# EAGLE design diagnostic-main (EAGLE 9.5.2)

## Sheet 1 of 3: MCU
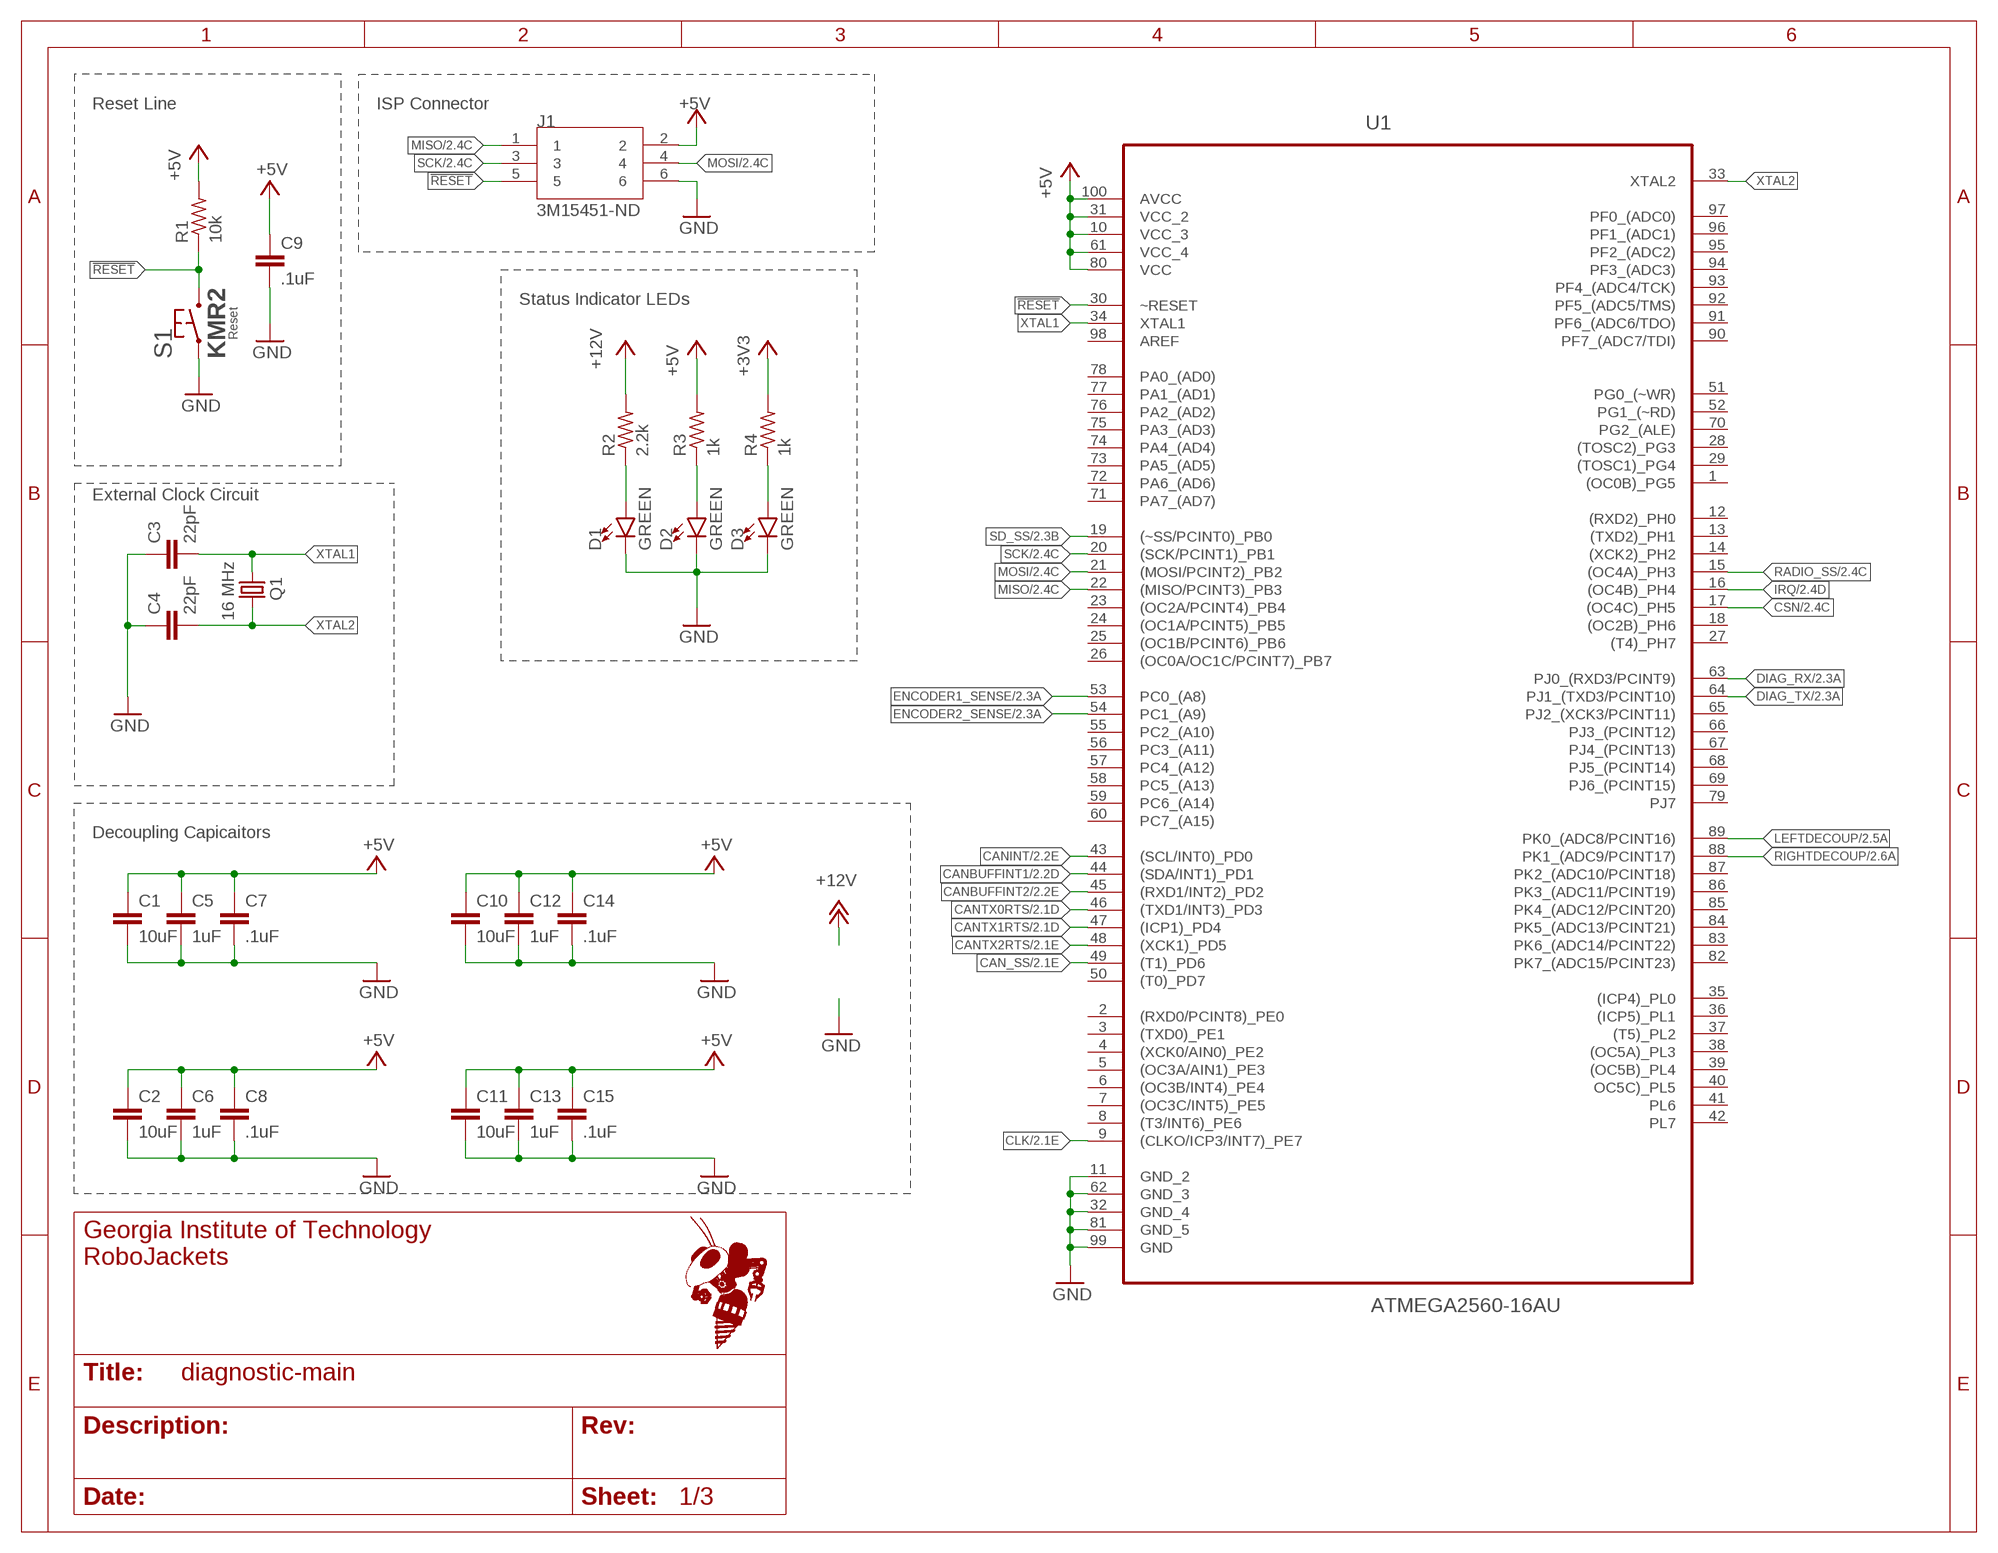
[diagram p0: schematic, sheet 1]

### Parts
C1  10uF  C-EUC0805  [C0805]
C2  10uF  C-EUC0805  [C0805]
C3  22pF  C-EUC0603  [C0603]
C4  22pF  C-EUC0603  [C0603]
C5  1uF  C-EUC0603  [C0603]
C6  1uF  C-EUC0603  [C0603]
C7  .1uF  C-EUC0603  [C0603]
C8  .1uF  C-EUC0603  [C0603]
C9  .1uF  C-EUC0603  [C0603]
C10  10uF  C-EUC0805  [C0805]
C11  10uF  C-EUC0805  [C0805]
C12  1uF  C-EUC0603  [C0603]
C13  1uF  C-EUC0603  [C0603]
C14  .1uF  C-EUC0603  [C0603]
C15  .1uF  C-EUC0603  [C0603]
D1  GREEN  LED-BLUE0603  [LED-0603]
D2  GREEN  LED-GREEN0603  [LED-0603]
D3  GREEN  LED-GREEN0603  [LED-0603]
J1  3M15451-ND  30306-6002HB  [3M_30306-6002HB]
Q1  16 MHz  CSM-7X-DU  [CSM-7X-DU]
R1  10k  R-US_R0603  [R0603]
R2  2.2k  R-US_R0603  [R0603]
R3  1k  R-US_R0603  [R0603]
R4  1k  R-US_R0603  [R0603]
S1  KMR2  [KMR2]
U1  ATMEGA2560-16AU  [QFP50P1600X1600X120-100N]

### Nets
3V3_LED_R: D3.A R4.1
5V_LED_R: D2.A R3.1
12V_LED_R: D1.A R2.1
!RESET: J1.5 R1.1 S1.2.1 S1.2.2 U1.30(~RESET)
+3V3: R4.2 ; also sheet 2,3
+5V: C1.1 C2.1 C5.1 C6.1 C7.1 C8.1 C9.1 C10.1 C11.1 C12.1 C13.1 C14.1 C15.1 J1.2 R1.2 R3.2 U1.10(VCC_3) U1.31(VCC_2) U1.61(VCC_4) U1.80(VCC) U1.100(AVCC) ; also sheet 2,3
+12V: R2.2 ; also sheet 2,3
CAN_SS: U1.49((T1)_PD6) ; also sheet 2
CANBUFFINT1: U1.44((SDA/INT1)_PD1) ; also sheet 2
CANBUFFINT2: U1.45((RXD1/INT2)_PD2) ; also sheet 2
CANINT: U1.43((SCL/INT0)_PD0) ; also sheet 2
CANTX0RTS: U1.46((TXD1/INT3)_PD3) ; also sheet 2
CANTX1RTS: U1.47((ICP1)_PD4) ; also sheet 2
CANTX2RTS: U1.48((XCK1)_PD5) ; also sheet 2
CLK: U1.9((CLKO/ICP3/INT7)_PE7) ; also sheet 2
CSN: U1.17((OC4C)_PH5) ; also sheet 2
DIAG_RX: U1.63(PJ0_(RXD3/PCINT9)) ; also sheet 2
DIAG_TX: U1.64(PJ1_(TXD3/PCINT10)) ; also sheet 2
ENCODER1_SENSE: U1.53(PC0_(A8)) ; also sheet 2
ENCODER2_SENSE: U1.54(PC1_(A9)) ; also sheet 2
GND: C1.2 C2.2 C3.1 C4.1 C5.2 C6.2 C7.2 C8.2 C9.2 C10.2 C11.2 C12.2 C13.2 C14.2 C15.2 D1.C D2.C D3.C J1.6 S1.1.1 S1.1.2 U1.11(GND_2) U1.32(GND_4) U1.62(GND_3) U1.81(GND_5) U1.99(GND) ; also sheet 2,3
IRQ: U1.16((OC4B)_PH4) ; also sheet 2
LEFTDECOUP: U1.89(PK0_(ADC8/PCINT16)) ; also sheet 2
MISO: J1.1 U1.22((MISO/PCINT3)_PB3) ; also sheet 2
MOSI: J1.4 U1.21((MOSI/PCINT2)_PB2) ; also sheet 2
RADIO_SS: U1.15((OC4A)_PH3) ; also sheet 2
RIGHTDECOUP: U1.88(PK1_(ADC9/PCINT17)) ; also sheet 2
SCK: J1.3 U1.20((SCK/PCINT1)_PB1) ; also sheet 2
SD_SS: U1.19((~SS/PCINT0)_PB0) ; also sheet 2
XTAL1: C3.2 Q1.1 U1.34(XTAL1)
XTAL2: C4.2 Q1.2 U1.33(XTAL2)
Unconnected: U1.1((OC0B)_PG5) U1.2((RXD0/PCINT8)_PE0) U1.3((TXD0)_PE1) U1.4((XCK0/AIN0)_PE2) U1.5((OC3A/AIN1)_PE3) U1.6((OC3B/INT4)_PE4) U1.7((OC3C/INT5)_PE5) U1.8((T3/INT6)_PE6) U1.12((RXD2)_PH0) U1.13((TXD2)_PH1) U1.14((XCK2)_PH2) U1.18((OC2B)_PH6) U1.23((OC2A/PCINT4)_PB4) U1.24((OC1A/PCINT5)_PB5) U1.25((OC1B/PCINT6)_PB6) U1.26((OC0A/OC1C/PCINT7)_PB7) U1.27((T4)_PH7) U1.28((TOSC2)_PG3) U1.29((TOSC1)_PG4) U1.35((ICP4)_PL0) U1.36((ICP5)_PL1) U1.37((T5)_PL2) U1.38((OC5A)_PL3) U1.39((OC5B)_PL4) U1.40(OC5C)_PL5) U1.41(PL6) U1.42(PL7) U1.50((T0)_PD7) U1.51(PG0_(~WR)) U1.52(PG1_(~RD)) U1.55(PC2_(A10)) U1.56(PC3_(A11)) U1.57(PC4_(A12)) U1.58(PC5_(A13)) U1.59(PC6_(A14)) U1.60(PC7_(A15)) U1.65(PJ2_(XCK3/PCINT11)) U1.66(PJ3_(PCINT12)) U1.67(PJ4_(PCINT13)) U1.68(PJ5_(PCINT14)) U1.69(PJ6_(PCINT15)) U1.70(PG2_(ALE)) U1.71(PA7_(AD7)) U1.72(PA6_(AD6)) U1.73(PA5_(AD5)) U1.74(PA4_(AD4)) U1.75(PA3_(AD3)) U1.76(PA2_(AD2)) U1.77(PA1_(AD1)) U1.78(PA0_(AD0)) U1.79(PJ7) U1.82(PK7_(ADC15/PCINT23)) U1.83(PK6_(ADC14/PCINT22)) U1.84(PK5_(ADC13/PCINT21)) U1.85(PK4_(ADC12/PCINT20)) U1.86(PK3_(ADC11/PCINT19)) U1.87(PK2_(ADC10/PCINT18)) U1.90(PF7_(ADC7/TDI)) U1.91(PF6_(ADC6/TDO)) U1.92(PF5_(ADC5/TMS)) U1.93(PF4_(ADC4/TCK)) U1.94(PF3_(ADC3)) U1.95(PF2_(ADC2)) U1.96(PF1_(ADC1)) U1.97(PF0_(ADC0)) U1.98(AREF)

### Notes on the sheet
- Reset Line | ISP Connector
- Status Indicator LEDs
- External Clock Circuit
- Decoupling Capicaitors

## Sheet 2 of 3: Connectors
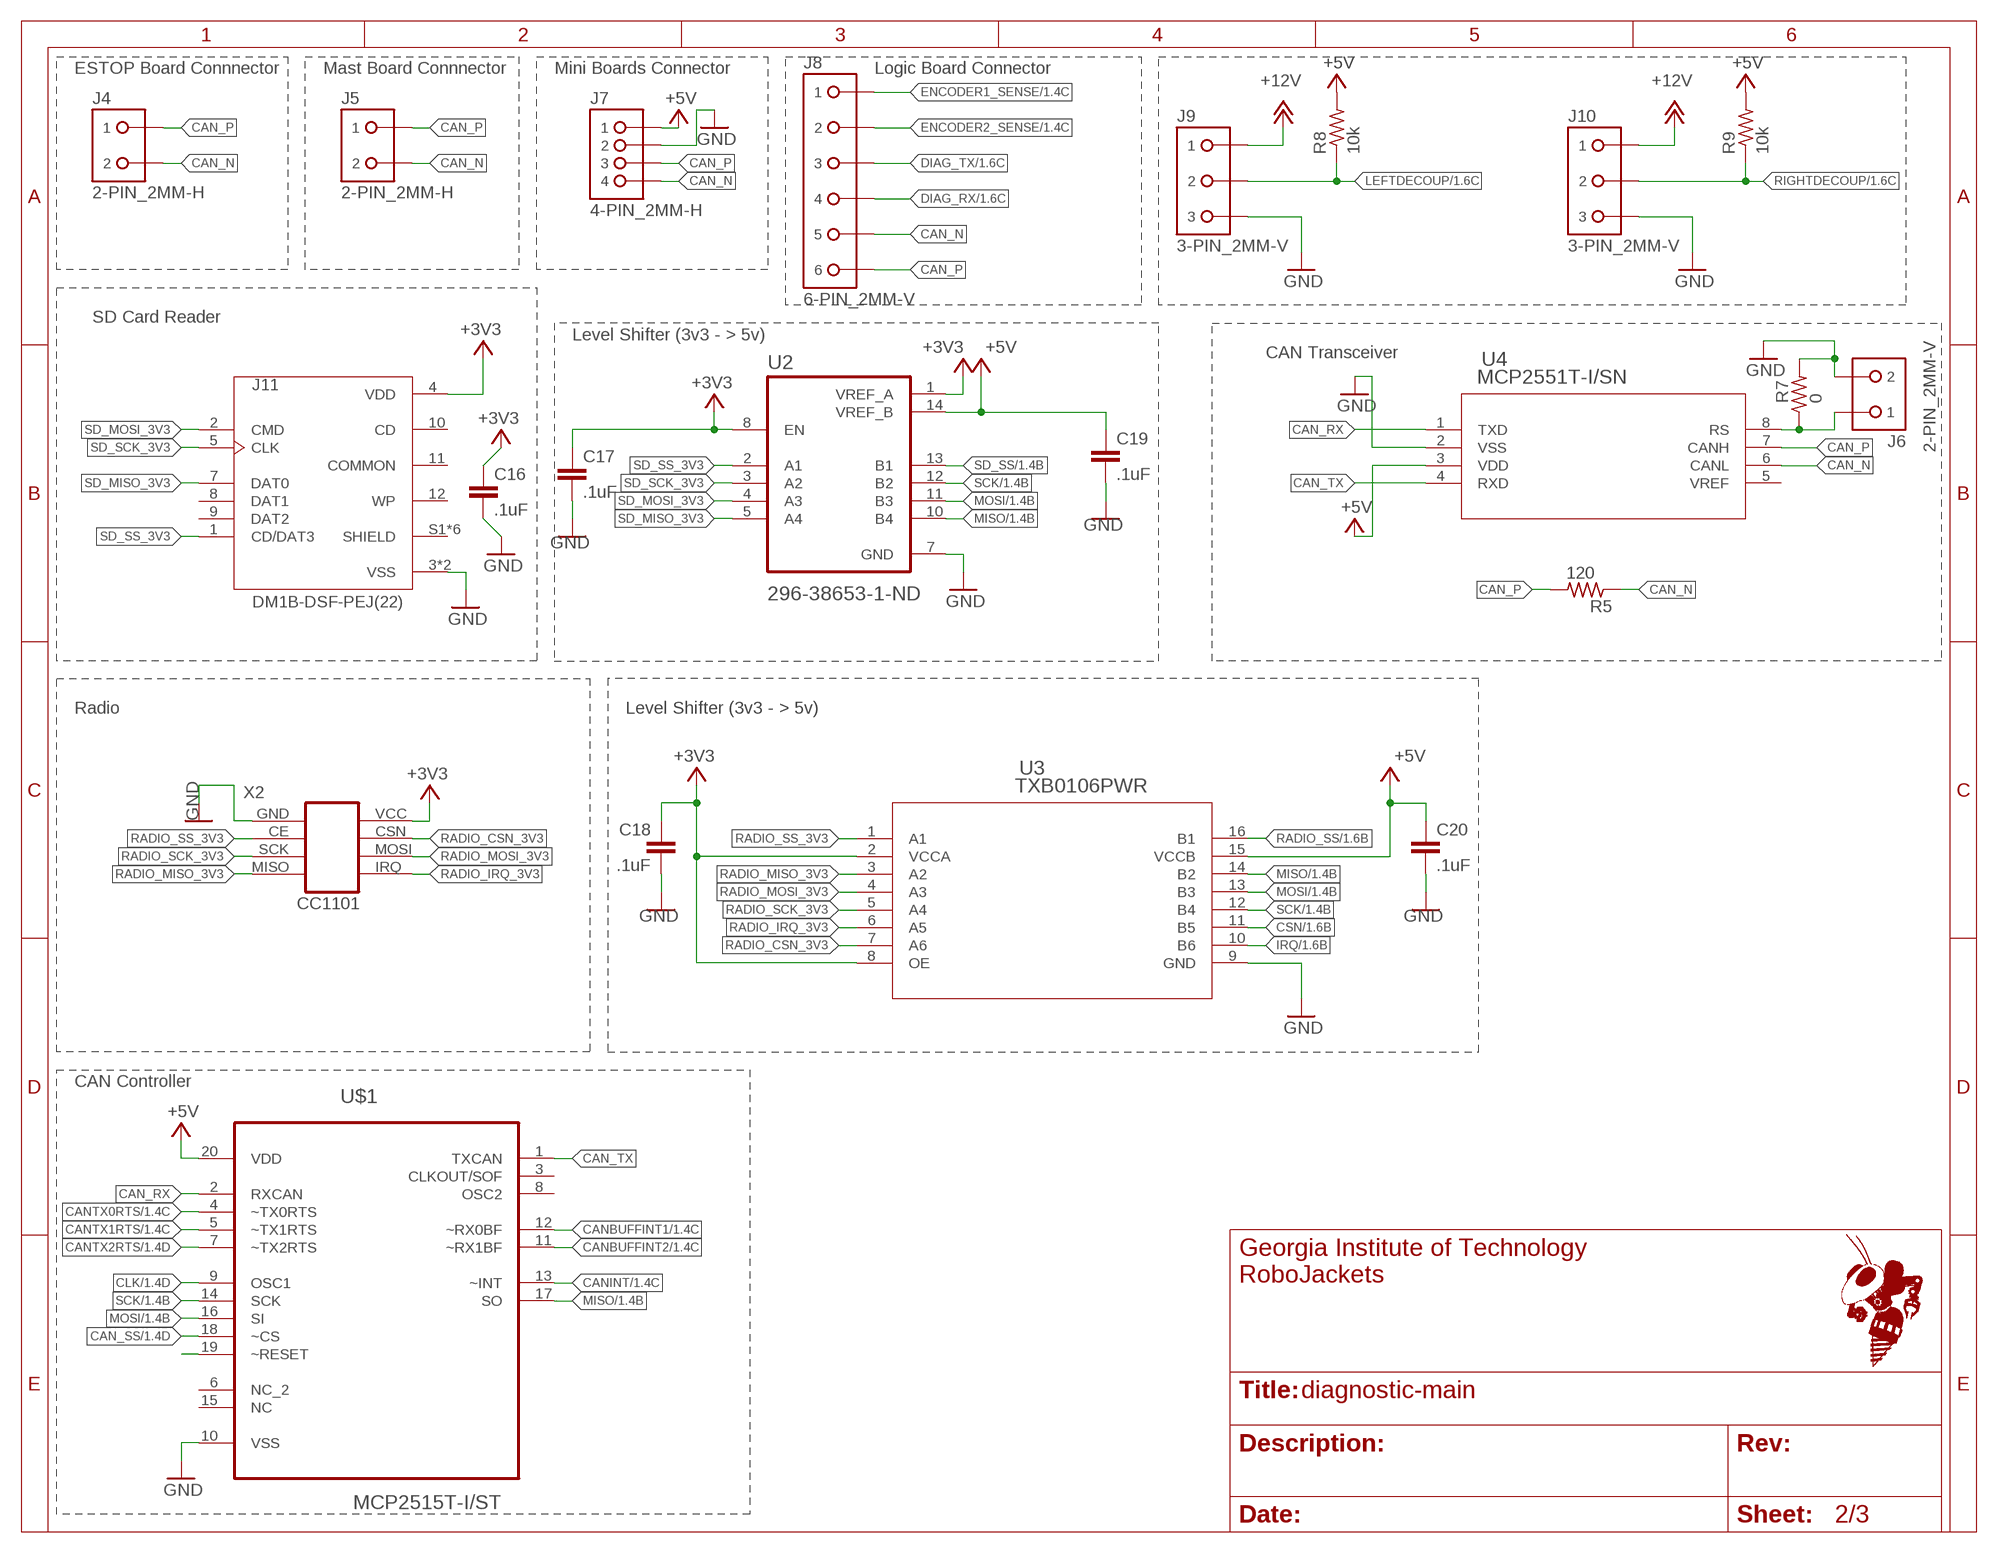
[diagram p1: schematic, sheet 2]

### Parts
C16  .1uF  C-EUC0603  [C0603]
C17  .1uF  C-EUC0603  [C0603]
C18  .1uF  C-EUC0603  [C0603]
C19  .1uF  C-EUC0603  [C0603]
C20  .1uF  C-EUC0603  [C0603]
J4  2-PIN_2MM-H  [2MM-2-H]
J5  2-PIN_2MM-H  [2MM-2-H]
J6  2-PIN_2MM-V  [2MM-2-V]
J7  4-PIN_2MM-H  [2MM-4-H]
J8  6-PIN_2MM-V  [2MM-6-V]
J9  3-PIN_2MM-V  [2MM-3-V]
J10  3-PIN_2MM-V  [2MM-3-V]
J11  DM1B-DSF-PEJ(22)  [JST_DM1B-DSF-PEJ(22)]
R5  120  R-US_R0603  [R0603]
R7  0  R-US_R0603  [R0603]
R8  10k  R-US_R0603  [R0603]
R9  10k  R-US_R0603  [R0603]
U2  296-38653-1-ND  LSF0204PWR  [SOP65P640X120-14N]
U3  TXB0106PWR  [PW16]
U4  MCP2551T-I/SN  [SOIC8-N_MC]
U$1  MCP2515T-I/ST  [SOP65P640X110-20N]
X2  CC1101  NRF24L01+PA+LNA  [NRF24L01+PA+LNA]

### Nets
+3V3: C16.1 C17.1 C18.1 J11.4(VDD) U2.1(VREF_A) U2.8(EN) U3.2(VCCA) U3.8(OE) X2.VCC ; also sheet 1,3
+5V: C19.1 C20.1 J7.1 R8.2 R9.2 U2.14(VREF_B) U3.15(VCCB) U4.3(VDD) U$1.20(VDD) ; also sheet 1,3
+12V: J9.1 J10.1 ; also sheet 1,3
CAN_N: J4.2 J5.2 J7.4 J8.5 R5.1 U4.6(CANL)
CAN_P: J4.1 J5.1 J7.3 J8.6 R5.2 U4.7(CANH)
CAN_RX: U4.1(TXD) U$1.2(RXCAN)
CAN_SS: U$1.18(~CS) ; also sheet 1
CAN_TX: U4.4(RXD) U$1.1(TXCAN)
CANBUFFINT1: U$1.12(~RX0BF) ; also sheet 1
CANBUFFINT2: U$1.11(~RX1BF) ; also sheet 1
CANINT: U$1.13(~INT) ; also sheet 1
CANTX0RTS: U$1.4(~TX0RTS) ; also sheet 1
CANTX1RTS: U$1.5(~TX1RTS) ; also sheet 1
CANTX2RTS: U$1.7(~TX2RTS) ; also sheet 1
CLK: U$1.9(OSC1) ; also sheet 1
CSN: U3.11(B5) ; also sheet 1
DIAG_RX: J8.4 ; also sheet 1
DIAG_TX: J8.3 ; also sheet 1
ENCODER1_SENSE: J8.1 ; also sheet 1
ENCODER2_SENSE: J8.2 ; also sheet 1
GND: C16.2 C17.2 C18.2 C19.2 C20.2 J6.2 J7.2 J9.3 J10.3 J11.3(VSS) J11.6(VSS) R7.2 U2.7(GND) U3.9(GND) U4.2(VSS) U$1.10(VSS) X2.GND ; also sheet 1,3
IRQ: U3.10(B6) ; also sheet 1
LEFTDECOUP: J9.2 R8.1 ; also sheet 1
MISO: U2.10(B4) U3.14(B2) U$1.17(SO) ; also sheet 1
MOSI: U2.11(B3) U3.13(B3) U$1.16(SI) ; also sheet 1
N$5: U$1.19(~RESET)
RADIO_CSN_3V3: U3.7(A6) X2.CSN
RADIO_IRQ_3V3: U3.6(A5) X2.IRQ
RADIO_MISO_3V3: U3.3(A2) X2.MISO
RADIO_MOSI_3V3: U3.4(A3) X2.MOSI
RADIO_SCK_3V3: U3.5(A4) X2.SCK
RADIO_SS: U3.16(B1) ; also sheet 1
RADIO_SS_3V3: U3.1(A1) X2.CE
RIGHTDECOUP: J10.2 R9.1 ; also sheet 1
RS: J6.1 R7.1 U4.8(RS)
SCK: U2.12(B2) U3.12(B4) U$1.14(SCK) ; also sheet 1
SD_MISO_3V3: J11.7(DAT0) U2.5(A4)
SD_MOSI_3V3: J11.2(CMD) U2.4(A3)
SD_SCK_3V3: J11.5(CLK) U2.3(A2)
SD_SS: U2.13(B1) ; also sheet 1
SD_SS_3V3: J11.1(CD/DAT3) U2.2(A1)
Unconnected: J11.8(DAT1) J11.9(DAT2) J11.10(CD) J11.11(COMMON) J11.12(WP) J11.S1(SHIELD) J11.S2(SHIELD) J11.S3(SHIELD) J11.S4(SHIELD) J11.S5(SHIELD) J11.S6(SHIELD) U4.5(VREF) U$1.3(CLKOUT/SOF) U$1.6(NC_2) U$1.8(OSC2) U$1.15(NC)

### Notes on the sheet
- ESTOP Board Connnector | Mast Board Connnector | Mini Boards Connector | Logic Board Connector
- SD Card Reader
- Level Shifter (3v3 - > 5v)
- CAN Transceiver
- Radio | Level Shifter (3v3 - > 5v)
- CAN Controller

## Sheet 3 of 3: Power
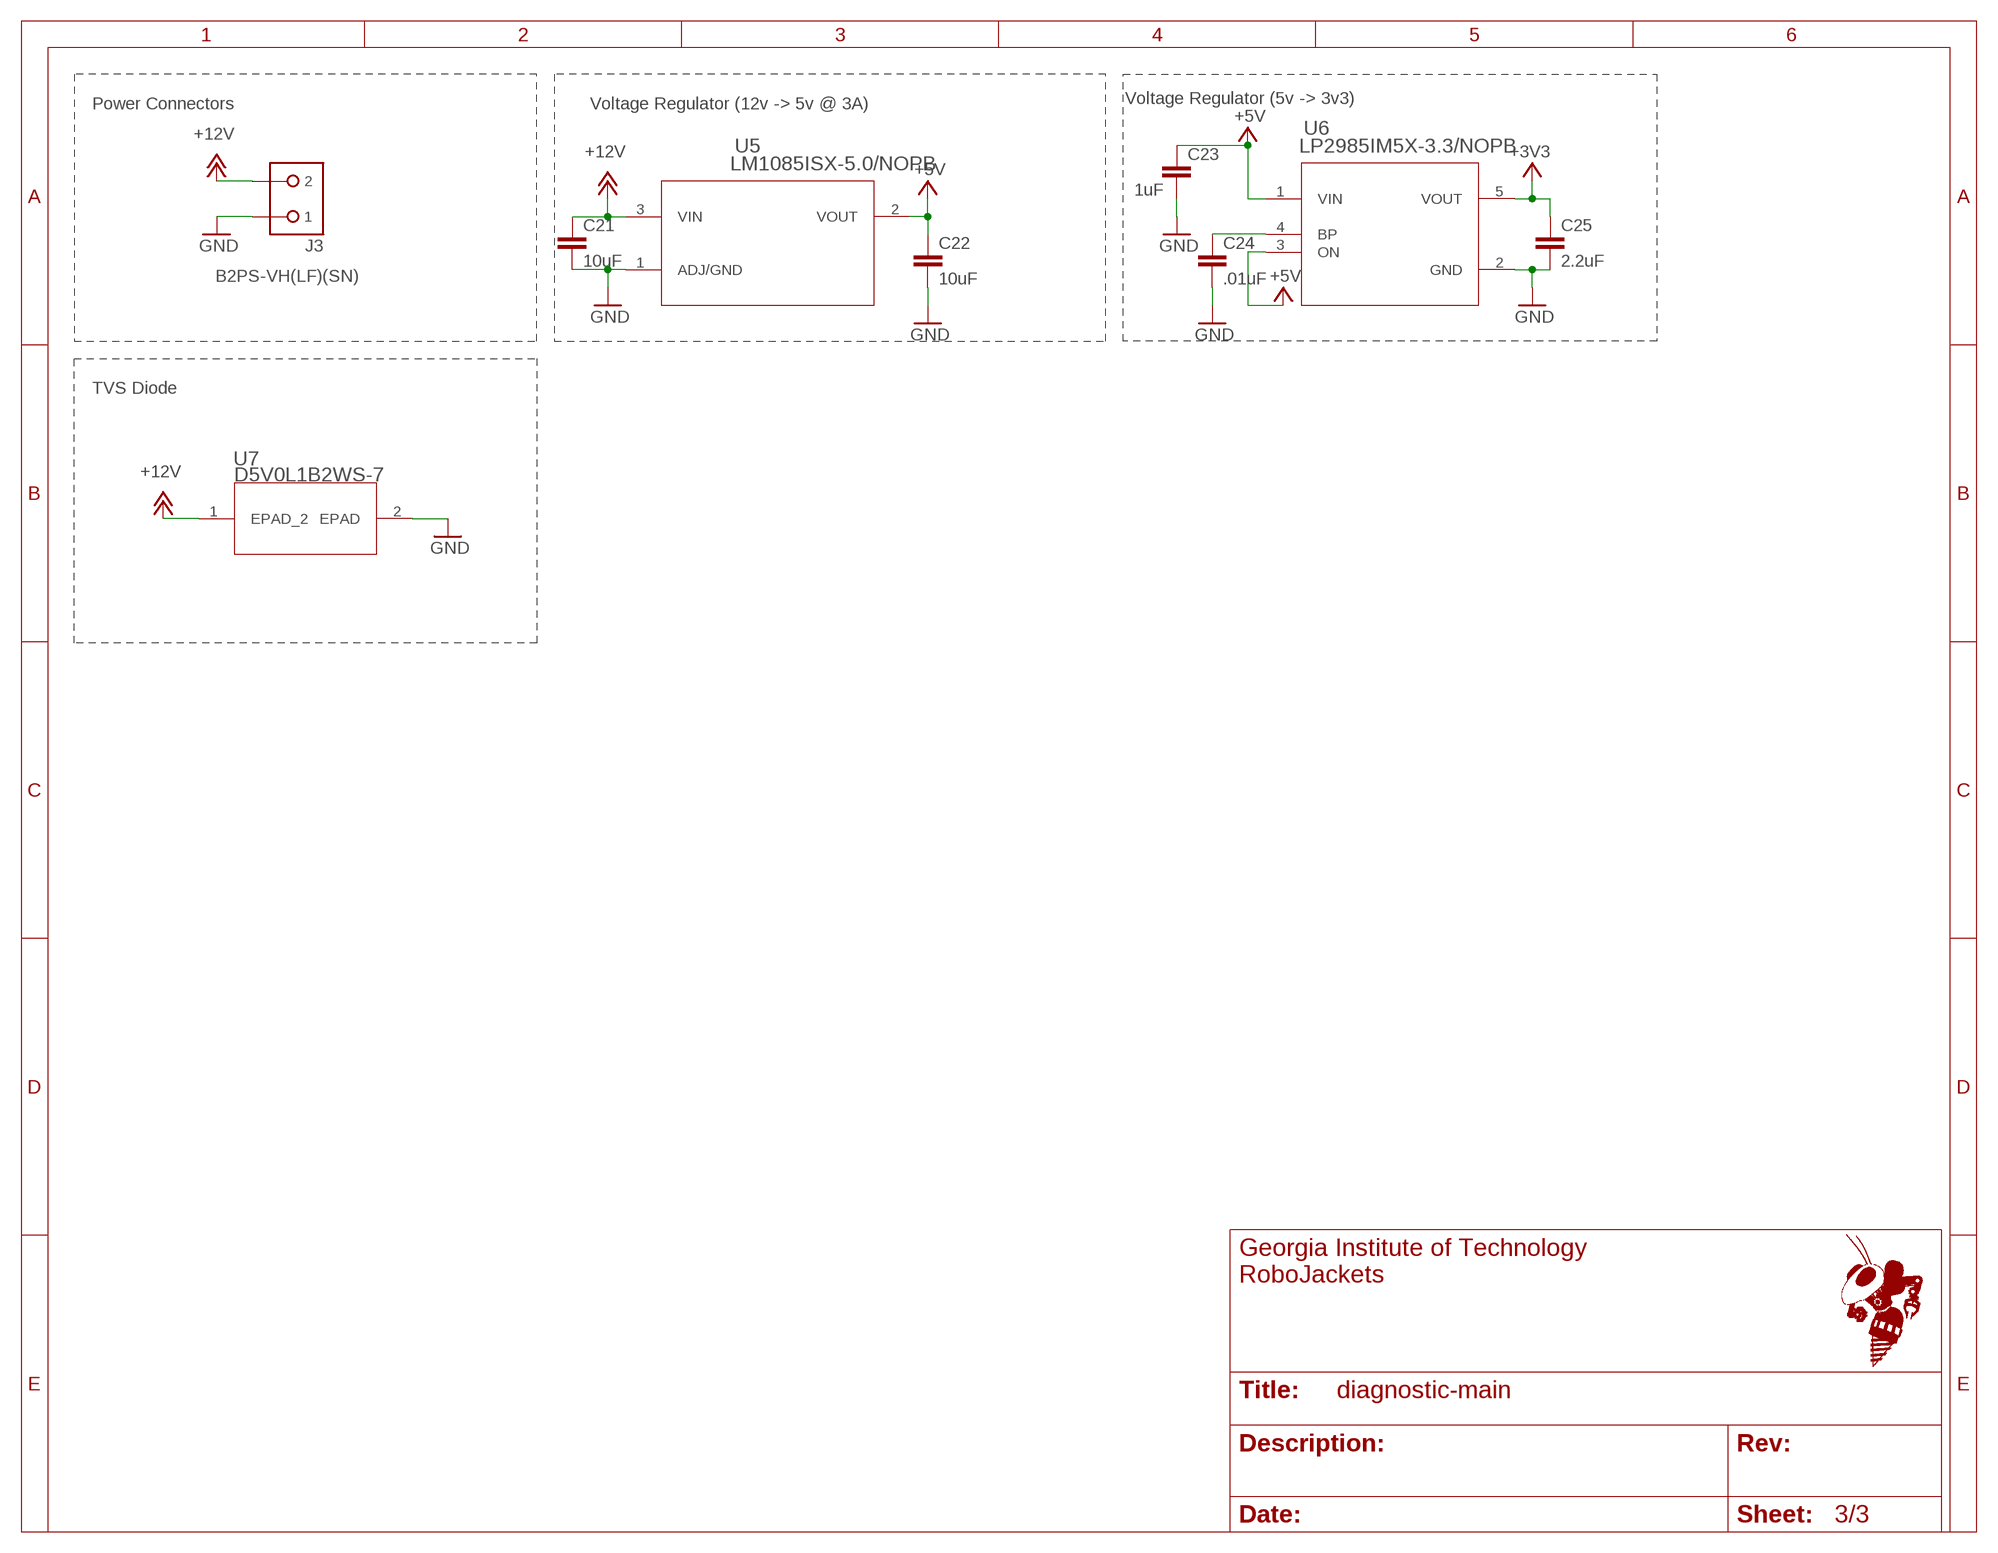
[diagram p2: schematic, sheet 3]

### Parts
C21  10uF  C-EUC0805  [C0805]
C22  10uF  C-EUC0805  [C0805]
C23  1uF  C-EUC0603  [C0603]
C24  .01uF  C-EUC0603  [C0603]
C25  2.2uF  C-EUC0603  [C0603]
J3  B2PS-VH(LF)(SN)  [B2PS-CENTERED]
U5  LM1085ISX-5.0/NOPB  [TS3B]
U6  LP2985IM5X-3.3/NOPB  [MF05A]
U7  D5V0L1B2WS-7  [SOD323]

### Nets
+3V3: C25.1 U6.5(VOUT) ; also sheet 1,2
+5V: C22.1 C23.1 U5.2(VOUT) U6.1(VIN) U6.3(ON) ; also sheet 1,2
+12V: C21.1 J3.2 U5.3(VIN) U7.1(EPAD_2) ; also sheet 1,2
GND: C21.2 C22.2 C23.2 C24.2 C25.2 J3.1 U5.1(ADJ/GND) U6.2(GND) U7.2(EPAD) ; also sheet 1,2
N$2: C24.1 U6.4(BP)

### Notes on the sheet
- Voltage Regulator (5v -> 3v3)
- Power Connectors | Voltage Regulator (12v -> 5v @ 3A)
- TVS Diode

## Library data of the parts
C1-C25 = rcl:C-EU: CAPACITOR, European symbol; SPICEPREFIX: C
D1 = SparkFun-LED:LED-BLUE: Blue SMD LED Used in manufacturing of various products at SparkFun Packages: 0603 - SMD 0603 package [Product Link] <http://www.digikey.com/product-detail/en/SMLE12BC7TT86/511-1589-2-ND/1641808> 1206 - SMD1206 package [Product Link] <http://www.digikey.com/product-detail/en/lite-on-inc/LTST-C150TBKT/160-1643-1-ND/573584> SparkFun Products: ESP8266 Thing-Dev Board <https://www.sparkfun.com/products/13711> RedBoard <https://www.sparkfun.com/products/12757>; PROD_ID: DIO-08575; VALUE: BLUE
D2 D3 = SparkFun-LED:LED-GREEN: Green SMD LED Used in manufacturing of various products at SparkFun Packages: 0603 - SMD 0603 package [Product Link] <http://www.futureelectronics.com/en/technologies/semiconductors/optoelectronics/leds/Pages/9894312-LTST-C190GKT.aspx?CrossPart=HSMG-C190&IM=0> LilyPad 1206 - SMD1206 LilyPad package [Product Link] <http://www.futureelectronics.com/en/Technologies/Product.aspx?ProductID=IN150NGHARVATEKCORPORATION2049943&IM=0> 1206 - SMD1206 package [Product Link] <http://www.futureelectronics.com/en/technologies/semiconductors/optoelectronics/leds/Pages/8315665-LTST-C150KGKT.aspx?IM=0> 1206 Bottom Mount -SMD 1206 Bottom Mount [Product Link] <http://www.digikey.com/product-detail/en/lite-on-inc/LTST-C230KGKT/160-1456-1-ND/386854> SparkFun Products: Pro Mini 328 -5V <https://www.sparkfun.com/products/821> RedBoard <https://www.sparkfun.com/products/12757> MP3 Trigger <https://www.sparkfun.com/products/13720> Makey Makey <https://www.sparkfun.com/products/11076>; PROD_ID: DIO-00821
J1 = 3M15451-ND:30306-6002HB: Conn Shrouded Header HDR 6 POS 2.54mm Solder ST Thru-Hole; DESCRIPTION: Conn Shrouded Header HDR 6 POS 2.54mm Solder ST Thru-Hole; DIGI-KEY_PART_NUMBER: 3M15451-ND; DIGI-KEY_PURCHASE_URL: https://www.digikey.com/product-detail/en/3m/30306-6002HB/3M15451-ND/1237391?utm_source=snapeda&utm_medium=aggregator&utm_campaign=symbol; MF: 3M; MP: 30306-6002HB; PACKAGE: None
J3 = RoboJackets-Connectors:B2P?-VH(LF)(SN): Power Connector Brand: JST Sales America Inc. <https://www.jst.com/> Series: VH <http://www.digikey.com/product-search/en?FV=fff40016,fff802f3,ffec0e9d> Distributor: Digi-Key <http://www.digikey.com/product-detail/en/B2PS-VH%28LF%29%28SN%29/455-1648-ND/926555>; DIGIKEY: 455-1648-ND; MPN: B2PS-VH(LF)(SN)
J4-J6 = RoboJackets-Connectors:2-PIN_2MM-*; PINS: 2; PIN_PITCH: 2.0 mm
J7 = RoboJackets-Connectors:4-PIN_2MM-*: MPN: 0353630460; DIGIKEY: WM18933-ND; MPN: 0353630460
J8 = RoboJackets-Connectors:6-PIN_2MM-*; PINS: 6; PIN_PITCH: 2.0 mm
J9 J10 = RoboJackets-Connectors:3-PIN_2MM-*; PINS: 3; PIN_PITCH: 2.0 mm
J11 = DM1B-DSF-PEJ_22_:DM1B-DSF-PEJ(22): DM1 Series 9 Position 2.9 mm Height SMT SD Memory Card; DESCRIPTION: 12 _9 + 3_ Position Card Connector Secure Digital - SD Surface Mount, Right Angle Gold; DIGI-KEY_PART_NUMBER: HR846CT-ND; DIGI-KEY_PURCHASE_URL: https://www.digikey.com/product-detail/en/hirose-electric-co-ltd/DM1B-DSF-PEJ_22_/HR846CT-ND/559986?utm_source=snapeda&utm_medium=aggregator&utm_campaign=symbol; MF: Hirose; MP: DM1B-DSF-PEJ_22_; PACKAGE: None
Q1 = crystal:CSM-7X-DU: SMD CRYSTAL Source: www.ecsxtal.com .. Crystal 3.6864MHz CSM_7X_DU.PDF; OC_FARNELL: unknown; OC_NEWARK: unknown
R1-R5 R7-R9 = rcl:R-US_: RESISTOR, American symbol; SPICEPREFIX: R
S1 = RoboJackets-Switches:KMR2; FUNCTION: Reset
U1 = ATMEGA2560-16AU:ATMEGA2560-16AU: Microcontroller; AVAILABILITY: Unavailable; DESCRIPTION: Embedded microcontroller ATMEGA2560-16AU TQFP 100 _14x14_ Microchip Technology 8-Bit 16 MHz I/O number 86; MF: Microchip; MP: ATMEGA2560-16AU; PACKAGE: TQFP-100 Microchip; PRICE: None
U2 = 296-38653-1-ND:LSF0204PWR: 4-Bit Bidirectional Multi-Voltage Level Translator for Open-Drain & Push- Pull 14-TSSOP -40 to 125; DESCRIPTION: 4-Bit Bidirectional Multi-Voltage Level Translator for Open-Drain & Push- Pull 14-TSSOP -40 to 125; DIGI-KEY_PART_NUMBER: 296-38653-1-ND; DIGI-KEY_PURCHASE_URL: https://www.digikey.com/product-detail/en/texas-instruments/LSF0204PWR/296-38653-1-ND/5056916?utm_source=snapeda&utm_medium=aggregator&utm_campaign=symbol; MF: Texas Instruments; MP: LSF0204PWR; PACKAGE: TSSOP-14 Texas Instruments
U3 = TXB0106PWR:TXB0106PWR; MANUFACTURER_PART_NUMBER: TXB0106PWR; VENDOR: Texas Instruments
U4 = MCP2551T:MCP2551T-I/SN; MANUFACTURER_PART_NUMBER: MCP2551TISN; VENDOR: Microchip
U5 = LM1085ISX:LM1085ISX-5.0/NOPB; MANUFACTURER_PART_NUMBER: LM1085ISX5.0NOPB; VENDOR: Texas Instruments
U6 = LP2985IM5X:LP2985IM5X-3.3/NOPB; MANUFACTURER_PART_NUMBER: LP2985IM5X3.3NOPB; VENDOR: Texas Instruments
U7 = IGVC-Discrete:D5V0L1B2WS-7; BUILT_BY: EMA_UL_Team; MANUFACTURER_PART_NUMBER: D5V0L1B2WS-7; VENDOR: Diodes Inc
U$1 = MCP2515T-I_ST:MCP2515T-I/ST: Stand-Alone CAN Controller; DESCRIPTION: CANbus Controller CAN 2.0 SPI Interface 20-TSSOP; DIGI-KEY_PART_NUMBER: MCP2515T-I/STCT-ND; DIGI-KEY_PURCHASE_URL: https://www.digikey.com/product-detail/en/microchip-technology/MCP2515T-I-ST/MCP2515T-I-STCT-ND/4307903?utm_source=snapeda&utm_medium=aggregator&utm_campaign=symbol; MF: Microchip; MP: MCP2515T-I/ST; PACKAGE: TSSOP-20 Microchip
X2 = IGVC-Connector:NRF24L01+PA+LNA: NRF24L01+PA+LNA

## Board
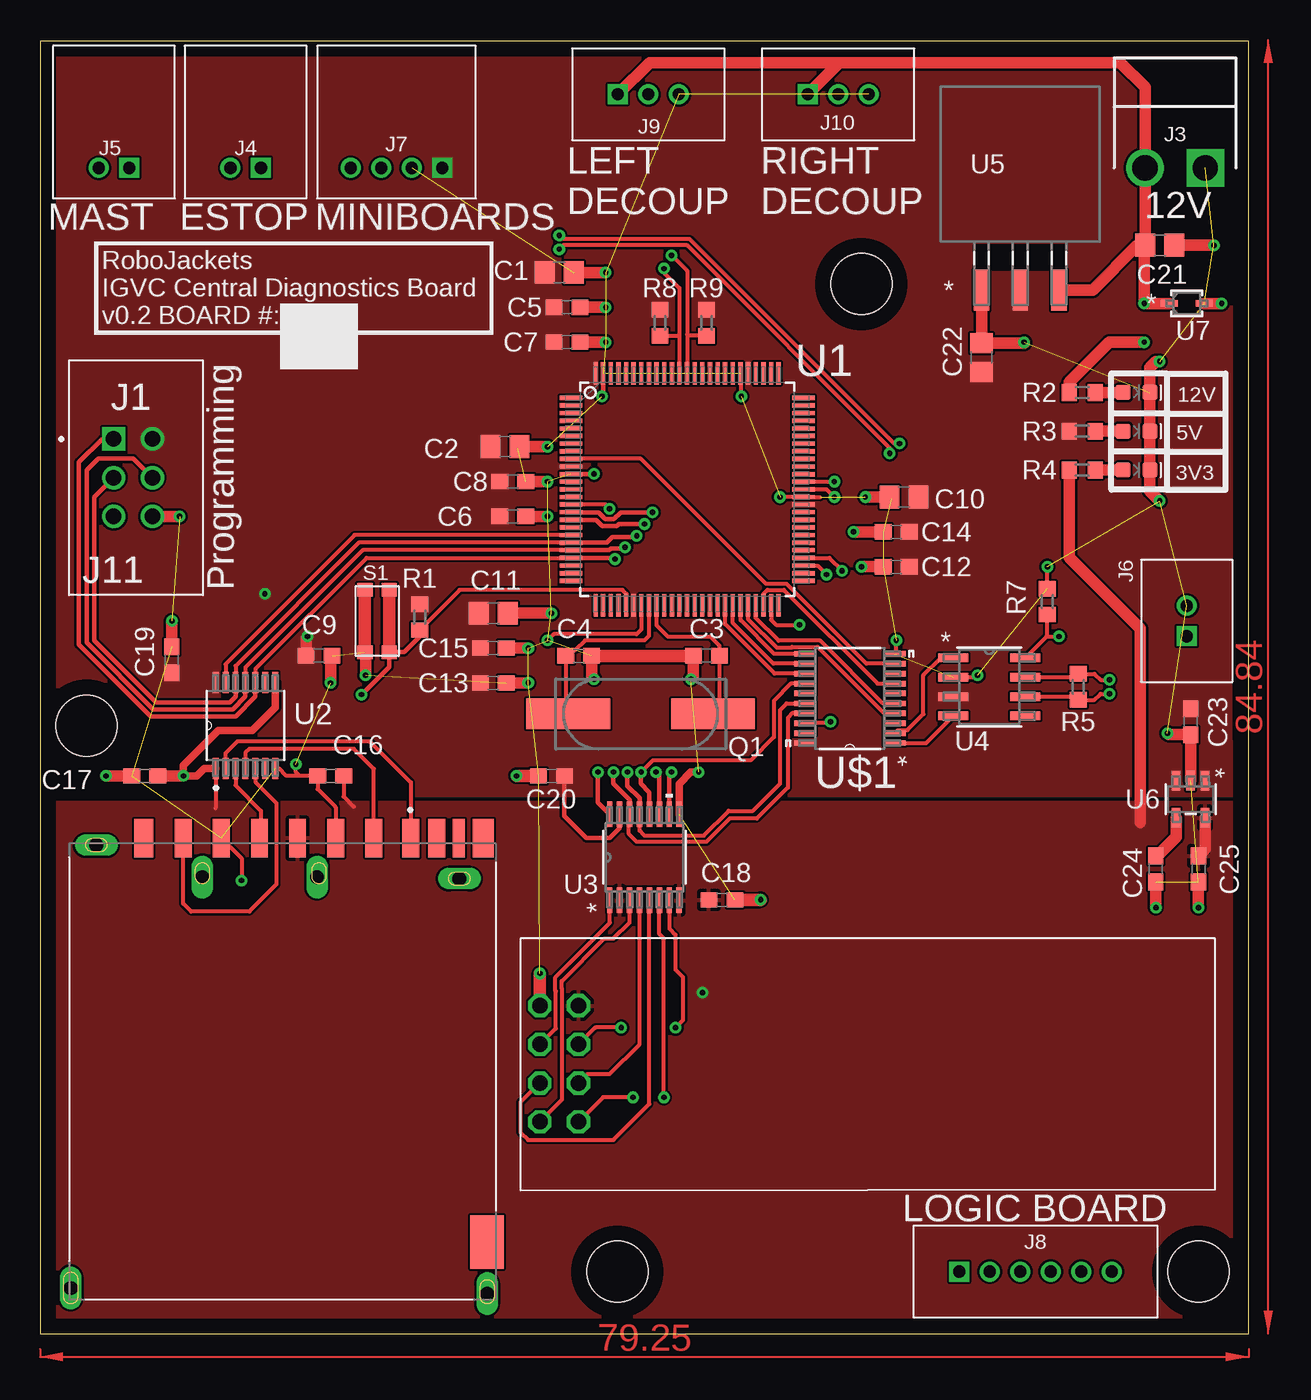
[diagram p3: board, top side]
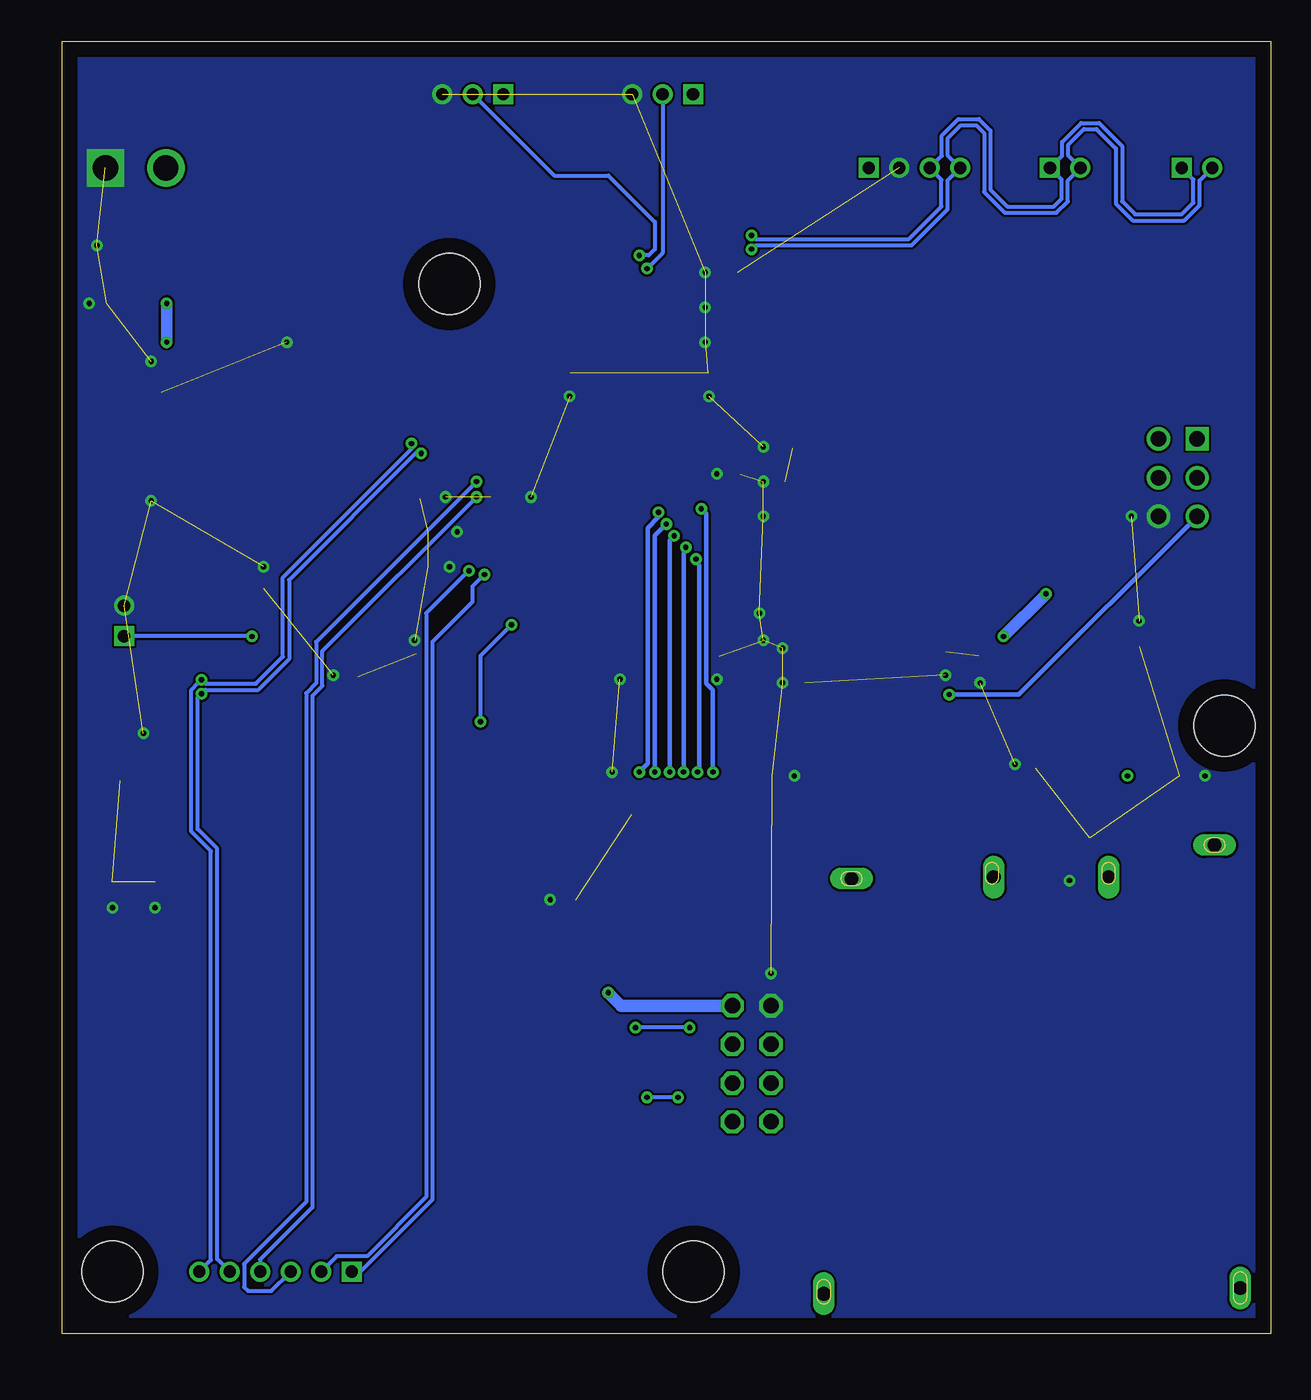
[diagram p4: board, bottom side, seen from below]

Size 79.23 x 84.76 mm. Coordinates in mm from the lower left corner, seen from the top.
Outline: 0,0 79.23,0 79.23,84.76 0,84.76 0,0
Copper layers (1*16): Top 0.035mm / dielectric 1.5mm / Bottom 0.035mm
Design rules "default": minimum track width 6mil, minimum drill 0.35mm, track to track 6mil, track to pad 6mil, pad to pad 6mil, via to via 6mil, smd to smd 6mil, copper to edge 40mil, drill to drill 6mil, minimum pad ring 10mil, minimum via ring 8mil, stop-mask expansion 4mil, vias tented up to drill 0mil, thermal gap 10mil
Holes 4 mm at 75.95,4.06 3.05,39.88 53.85,68.83 37.85,4.06

### Footprints (pad centres in the part's own frame; a part is rotated, then mirrored left to right if it is on the bottom)
C0805 = smd 1.3 x 1.5: 1 -0.95,0; 2 0.95,0
C0603 = smd 1.1 x 1: 1 -0.85,0; 2 0.85,0
LED-0603 = smd 1 x 1: A -0.877,0; C 0.877,0
3M_30306-6002HB = drill 1.02 pad 1.52 square: 1 0,0 | drill 1.02 pad 1.52: 2 2.54,0; 3 0,-2.54; 4 2.54,-2.54; 5 0,-5.08; 6 2.54,-5.08
B2PS-CENTERED = drill 1.65 square: 1 -1.98,0 | drill 1.65: 2 1.98,0
2MM-2-H = drill 0.8 square: 1 0,0 | drill 0.8: 2 2,0
2MM-2-V = drill 0.8 square: 1 -1,0 | drill 0.8: 2 1,0
2MM-4-H = drill 0.8 square: 1 -3,0 | drill 0.8: 2 -1,0; 3 1,0; 4 3,0
2MM-6-V = drill 0.8 square: 1 -4,0 | drill 0.8: 2 -2,0; 3 0,0; 4 2,0; 5 4,0; 6 6,0
2MM-3-V = drill 0.8 square: 1 -2,0 | drill 0.8: 2 0,0; 3 2,0
JST_DM1B-DSF-PEJ(22) = smd 1.1 x 2.5: 1 8.05,1.25; 2 5.625,1.25; 3 3.125,1.25; 4 0.625,1.25; 5 -1.875,1.25; 6 -4.375,1.25; 7 -6.875,1.25; 9 9.75,1.25 | smd 1.25 x 2.5: 8 -9.47,1.25 | smd 0.8 x 2.5: 10 11.2,1.25 | smd 1.4 x 2.5: 11 12.8,1.25 | smd 2.2 x 3.5: 12 13.03,-25.23 | drill 0.9 pad 1.3 long: S1 -12.57,0.8; S4 11.23,-1.4; S5 -14.25,-28.25; S6 13.06,-28.627 | drill 0.9 pad 1.1 long: S2 -5.62,-1.304; S3 1.903,-1.304
CSM-7X-DU = smd 5.5 x 2: 1 -4.75,0; 2 4.75,0
R0603 = smd 1 x 1.1: 1 -0.85,0; 2 0.85,0
KMR2 = smd 0.9 x 1: 1.1 -2.05,0.8; 1.2 2.05,0.8; 2.1 -2.05,-0.8; 2.2 2.05,-0.8
QFP50P1600X1600X120-100N = smd 1.473 x 0.279: 1 -7.62,5.994; 2 -7.62,5.512; 3 -7.62,5.004; 4 -7.62,4.496; 5 -7.62,3.988; 6 -7.62,3.505; 7 -7.62,2.997; 8 -7.62,2.489; 9 -7.62,2.007; 10 -7.62,1.499; 11 -7.62,0.991; 12 -7.62,0.508; 13 -7.62,0; 14 -7.62,-0.508; 15 -7.62,-0.991; 16 -7.62,-1.499; 17 -7.62,-2.007; 18 -7.62,-2.489; 19 -7.62,-2.997; 20 -7.62,-3.505; 21 -7.62,-3.988; 22 -7.62,-4.496; 23 -7.62,-5.004; 24 -7.62,-5.512; 25 -7.62,-5.994; 51 7.62,-5.994; 52 7.62,-5.512; 53 7.62,-5.004; 54 7.62,-4.496; 55 7.62,-3.988; 56 7.62,-3.505; 57 7.62,-2.997; 58 7.62,-2.489; 59 7.62,-2.007; 60 7.62,-1.499; 61 7.62,-0.991; 62 7.62,-0.508; 63 7.62,0; 64 7.62,0.508; 65 7.62,0.991; 66 7.62,1.499; 67 7.62,2.007; 68 7.62,2.489; 69 7.62,2.997; 70 7.62,3.505; 71 7.62,3.988; 72 7.62,4.496; 73 7.62,5.004; 74 7.62,5.512; 75 7.62,5.994 | smd 0.279 x 1.473: 26 -5.994,-7.62; 27 -5.512,-7.62; 28 -5.004,-7.62; 29 -4.496,-7.62; 30 -3.988,-7.62; 31 -3.505,-7.62; 32 -2.997,-7.62; 33 -2.489,-7.62; 34 -2.007,-7.62; 35 -1.499,-7.62; 36 -0.991,-7.62; 37 -0.508,-7.62; 38 0,-7.62; 39 0.508,-7.62; 40 0.991,-7.62; 41 1.499,-7.62; 42 2.007,-7.62; 43 2.489,-7.62; 44 2.997,-7.62; 45 3.505,-7.62; 46 3.988,-7.62; 47 4.496,-7.62; 48 5.004,-7.62; 49 5.512,-7.62; 50 5.994,-7.62; 76 5.994,7.62; 77 5.512,7.62; 78 5.004,7.62; 79 4.496,7.62; 80 3.988,7.62; 81 3.505,7.62; 82 2.997,7.62; 83 2.489,7.62; 84 2.007,7.62; 85 1.499,7.62; 86 0.991,7.62; 87 0.508,7.62; 88 0,7.62; 89 -0.508,7.62; 90 -0.991,7.62; 91 -1.499,7.62; 92 -2.007,7.62; 93 -2.489,7.62; 94 -2.997,7.62; 95 -3.505,7.62; 96 -3.988,7.62; 97 -4.496,7.62; 98 -5.004,7.62; 99 -5.512,7.62; 100 -5.994,7.62
SOP65P640X120-14N = smd 1.37 x 0.39: 1 -2.82,1.95; 2 -2.82,1.3; 3 -2.82,0.65; 4 -2.82,0; 5 -2.82,-0.65; 6 -2.82,-1.3; 7 -2.82,-1.95; 8 2.82,-1.95; 9 2.82,-1.3; 10 2.82,-0.65; 11 2.82,0; 12 2.82,0.65; 13 2.82,1.3; 14 2.82,1.95
PW16 = smd 1.676 x 0.356: 1 -2.819,2.275; 2 -2.819,1.625; 3 -2.819,0.975; 4 -2.819,0.325; 5 -2.819,-0.325; 6 -2.819,-0.975; 7 -2.819,-1.625; 8 -2.819,-2.275; 9 2.819,-2.275; 10 2.819,-1.625; 11 2.819,-0.975; 12 2.819,-0.325; 13 2.819,0.325; 14 2.819,0.975; 15 2.819,1.625; 16 2.819,2.275
SOIC8-N_MC = smd 1.981 x 0.559: 1 -2.362,1.905; 2 -2.362,0.635; 3 -2.362,-0.635; 4 -2.362,-1.905; 5 2.362,-1.905; 6 2.362,-0.635; 7 2.362,0.635; 8 2.362,1.905
TS3B = smd 1.016 x 2.692: 1 -2.54,-8.28; 2 0,-8.28; 3 2.54,-8.28
MF05A = smd 1.27 x 0.559: 1 -1.219,0.953; 2 -1.219,0; 3 -1.219,-0.953; 4 1.219,-0.953; 5 1.219,0.953
SOD323 = smd 1.111 x 0.401: 1 -1.15,0; 2 1.15,0
SOP65P640X110-20N = smd 1.422 x 0.356: 1 -2.946,2.921; 2 -2.946,2.286; 3 -2.946,1.626; 4 -2.946,0.965; 5 -2.946,0.33; 6 -2.946,-0.33; 7 -2.946,-0.965; 8 -2.946,-1.626; 9 -2.946,-2.286; 10 -2.946,-2.921; 11 2.946,-2.921; 12 2.946,-2.286; 13 2.946,-1.626; 14 2.946,-0.965; 15 2.946,-0.33; 16 2.946,0.33; 17 2.946,0.965; 18 2.946,1.626; 19 2.946,2.286; 20 2.946,2.921
NRF24L01+PA+LNA = drill 1.016 octagon: CE 21.59,-0.68; CSN 19.05,-0.68; GND 21.59,-3.22; IRQ 19.05,4.4; MISO 21.59,4.4; MOSI 19.05,1.86; SCK 21.59,1.86; VCC 19.05,-3.22

### Placement (x,y rotation side)
C1  34.04,69.6 0 top
C2  30.48,58.17 0 top
C3  43.69,44.45 0 top
C4  35.31,44.45 180 top
C5  34.54,67.31 0 top
C6  30.99,53.59 0 top
C7  34.54,65.02 0 top
C8  30.99,55.88 0 top
C9  18.29,44.45 0 top
C10  56.64,54.86 180 top
C11  29.72,47.24 0 top
C12  56.13,50.29 180 top
C13  29.72,42.67 0 top
C14  56.13,52.58 180 top
C15  29.72,44.96 0 top
C16  19.05,36.58 180 top
C17  6.86,36.58 180 top
C18  44.7,28.45 0 top
C19  8.64,44.2 90 top
C20  33.53,36.58 180 top
C21  73.41,71.37 0 top
C22  61.72,64.01 90 top
C23  75.44,40.13 270 top
C24  73.15,30.48 270 top
C25  75.95,30.48 270 top
D1  71.88,61.72 0 top
D2  71.88,59.18 0 top
D3  71.88,56.64 0 top
J1  4.83,58.67 0 top
J3  74.42,76.45 180 top
J4  14.48,76.45 180 top
J5  5.84,76.45 180 top
J6  75.18,46.74 90 top
J7  23.37,76.45 180 top
J8  64.26,4.06 0 top
J9  39.88,81.28 0 top
J10  52.32,81.28 0 top
J11  16.26,31.24 0 top
Q1  39.37,40.64 180 top
R1  24.89,46.99 90 top
R2  68.33,61.72 180 top
R3  68.33,59.18 180 top
R4  68.33,56.64 180 top
R5  68.07,42.42 90 top
R7  66.04,48.01 90 top
R8  40.64,66.29 90 top
R9  43.69,66.29 90 top
S1  22.1,46.74 90 top
U1  42.42,55.37 0 top
U2  13.46,39.88 90 top
U3  39.62,31.24 90 top
U4  62.23,42.42 0 top
U5  64.26,76.71 0 top
U6  75.44,35.05 270 top
U7  75.18,67.56 0 top
U$1  53.09,41.66 180 top
X2  54.36,18.29 180 top

### Tracks (layer width: path | path; a pad name or v marks a point on that pad's centre or on a via)
3V3_LED_R
  Top 0.762: R4.1 D3.A
5V_LED_R
  Top 0.762: R3.1 D2.A
12V_LED_R
  Top 0.762: R2.1 D1.A
!RESET  (via drill 0.35)
  Top 0.254: 22.9,48.77 S1.2.2 | U1.30 38.43,48.51 38.18,48.77 27.49,48.77 27.41,48.66 R1.1
  Top 0.305: v21.08,41.91 22.9,43.73 S1.2.1 23.86,44.69 24.89,45.72 R1.1
  Top 0.813: S1.2.1 22.9,48.77
  Bottom 0.305: J1.5 16.51,41.91 v21.08,41.91
+3V3  (via drill 0.35)
  Top 0.254: U2.1 11.51,34.46 | C16.1 19.9,35.22 20.57,34.54
  Top 0.508: U2.1 10.75,37.06 10.27,36.58 v9.4,36.58 9.4,37.26 11.68,39.55 13.89,39.55 15.41,41.07 U2.8
  Top 0.762: C17.1 v9.4,36.58 | U6.5 76.39,31.77 C25.1 | 72.14,33.53 72.14,46.23 67.48,50.89 R4.2
  Bottom 0.813: X2.VCC 42.59,21.51 v43.43,22.35
  pour Top: 0,34.8 0,-0.51 79.25,-0.51 79.25,34.8
+5V  (via drill 0.35)
  Top 0.305: U3.15 38,33.17 37.34,32.51 35.81,32.51 34.38,33.95 C20.1
  Top 0.762: C9.1 17.44,45.63 v17.53,45.72
  Bottom 0.762: v17.53,45.72 v14.73,48.51
  pour Top (no thermals): 0,84.84 79.25,84.84 79.25,35.31 0,35.31
+12V  (via drill 0.35)
  Top 0.762: C21.1 71.95,71.37 69,68.43 U5.3 | C21.1 72.39,71.31 v72.39,67.56 U7.1 | C21.1 72.46,76.44 J3.2 72.44,81.74 70.81,83.36 52.41,83.36 | v72.39,65.02 70.1,65.02 67.48,62.4 R2.2 | 52.41,83.36 J10.1 | J9.1 39.96,83.36 52.41,83.36
  Bottom 0.762: v72.39,65.02 v72.39,67.56
CAN_N  (via drill 0.35)
  Top 0.254: v55.7,57.73 55.7,58.09 42.42,71.37 34.29,71.37 v34.04,71.12 | U4.6 67.86,41.78 R5.1 69.13,41.57 69.53,41.96 v70.1,41.96
  Bottom 0.254: v55.7,57.73 56.06,57.73 64.36,49.43 64.36,44.23 66.38,42.22 69.85,42.22 v70.1,41.96 70.36,41.71 70.36,33.09 69.09,31.82 69.09,4.89 J8.5 | J5.2 4.67,75.62 4.67,74 5.67,73 9.06,73 10.16,74.1 10.16,77.72 11.43,78.99 12.26,78.99 13.28,77.98 13.28,77.25 J4.2 13.31,75.62 13.31,74.25 14.06,73.51 17.44,73.51 18.8,74.86 18.8,78.74 19.3,79.25 20.32,79.25 21.16,78.4 21.16,77.25 J7.4 21.18,75.64 21.18,73.75 23.55,71.37 33.78,71.37 v34.04,71.12
CAN_P  (via drill 0.35)
  Top 0.254: v56.34,58.38 55.99,58.38 42.59,71.78 34.29,71.78 v34.04,72.03 | U4.7 67.86,43.05 R5.2 69.13,43.27 69.53,42.87 v70.1,42.87
  Bottom 0.254: v56.34,58.38 56.34,58.02 64.77,49.6 64.77,44.4 66.55,42.62 69.85,42.62 v70.1,42.87 70.36,42.62 70.38,42.62 70.76,42.24 70.76,42.22 70.76,42.21 70.76,32.92 69.49,31.65 69.49,4.83 J8.6 | J5.1 5.08,75.69 5.08,74.17 5.84,73.41 8.89,73.41 9.75,74.27 9.75,77.89 11.26,79.4 12.43,79.4 13.68,78.15 13.68,77.25 J4.1 13.72,75.69 13.72,74.42 14.22,73.91 17.27,73.91 18.39,75.03 18.39,78.91 19.14,79.65 20.49,79.65 21.57,78.57 21.57,77.25 J7.3 21.59,75.68 21.59,73.91 23.72,71.78 33.78,71.78 v34.04,72.03
CAN_RX
  Top 0.254: U$1.2 56.24,39.57 56.86,39.57 57.91,40.63 57.91,43.18 59.05,44.32 U4.1
CAN_SS  (via drill 0.35)
  Top 0.254: v51.82,40.13 51.71,40.03 U$1.18 | U1.49 47.93,46.81 48.26,46.48 v49.78,46.48
  Bottom 0.254: v49.78,46.48 51.82,44.45 v51.82,40.13
CAN_TX
  Top 0.254: U$1.1 58.09,38.73 U4.4
CANBUFFINT1
  Top 0.254: U$1.12 48.07,43.94 45.41,46.6 U1.44
CANBUFFINT2
  Top 0.254: U$1.11 48.13,44.58 45.92,46.79 U1.45
CANINT
  Top 0.254: U$1.13 48.16,43.28 44.91,46.53 U1.43
CANTX0RTS
  Top 0.254: U1.46 46.41,46.88 48.3,44.98 49.26,44.98 49.31,45.03 50.98,45.03 55.32,40.69 U$1.4
CANTX1RTS
  Top 0.254: U$1.5 55.26,41.33 51.15,45.44 48.42,45.44 46.91,46.95 U1.47
CANTX2RTS
  Top 0.254: U$1.7 54.91,42.62 48.77,48.77 47.67,48.77 47.42,48.52 U1.48
CLK
  Top 0.254: U$1.9 54.17,43.94 48.94,49.17 47.6,49.17 39.4,57.38 U1.9
CSN  (via drill 0.35)
  Top 0.305: U3.11 40.6,36.62 v40.39,36.83 | v39.63,53.09 v39.62,53.09 37.93,53.09 37.81,52.96 36.87,52.96 36.46,53.37 U1.17
  Bottom 0.305: v40.39,36.83 40.39,52.34 v39.63,53.09
DIAG_RX  (via drill 0.35)
  Top 0.254: v52.07,54.86 51.56,55.37 U1.63
  Bottom 0.254: v52.07,54.86 62.18,44.75 62.18,42.48 62.84,41.83 62.84,8.28 66.26,4.86 J8.4
DIAG_TX  (via drill 0.35)
  Top 0.254: U1.64 v52.07,55.88
  Bottom 0.254: v52.07,55.88 62.59,45.36 62.59,42.65 63.25,42 63.25,8.64 67.31,4.57 67.31,3.05 67.06,2.79 65.53,2.79 J8.3
ENCODER1_SENSE  (via drill 0.35)
  Top 0.254: U1.53 50.98,50.37 v51.56,49.78
  Bottom 0.254: v51.56,49.78 52.32,49.02 52.32,48.01 54.97,45.36 54.97,8.79 59.69,4.06 J8.1
ENCODER2_SENSE  (via drill 0.35)
  Top 0.254: U1.54 51.74,50.88 v52.58,50.04
  Bottom 0.254: v52.58,50.04 55.37,47.24 55.37,8.96 59.25,5.08 61.25,5.08 J8.2
GND  (via drill 0.35)  (44 unrouted)
  Top 0.254: U1.32 39.42,46.18 39.12,45.87 33.68,45.87 v33.27,45.47 | v48.51,54.86 U1.62 51.14,54.86 | U1.81 45.92,61.52 v45.97,61.47 | U2.7 15.67,37.06 16.15,36.58 17.02,36.58 | C16.2 17.02,36.58 | C16.2 18.2,36.66 | C16.2 18.2,35.7 19.38,34.52 J11.3 | 17.02,36.58 16.76,36.83 v16.76,37.34 | J11.6 13.21,31.16 v13.21,29.72 | U$1.10 56.13,44.68 v56.13,45.47 | U4.2 61.34,43.05 v61.47,43.18 | R7.2 v66.04,50.29
  Top 0.305: U1.99 36.91,61.54 v36.83,61.47 | U1.11 36.3,56.36 v36.32,56.39
  Top 0.508: v43.18,36.83 42.67,36.83 41.9,36.06 U3.9
  Top 0.762: v76.96,71.37 C21.2 | U6.2 C23.2 74,39.28 v73.91,39.37 | v64.52,65.02 64.52,64.96 C22.2 U5.1 | v73.41,63.75 73.15,63.75 72.76,63.36 D1.C D2.C D3.C 72.76,55.26 v73.41,54.61 | 30.67,45.06 C15.2 v32,44.96 | v33.53,47.24 C11.2 | S1.1.1 21.34,44.65 v21.34,43.18 | 31.33,58.07 C2.2 v33.27,58.17 | 55.79,54.76 C10.2 v54.1,54.86 | C17.2 v4.32,36.58 | J1.6 v9.14,53.59 | v33.27,53.59 C6.2 | C4.1 36.16,43.09 v36.32,42.93 | C3.1 42.84,43.09 v42.67,42.93 | C9.2 19.05,44.36 v19.05,42.67 | C8.2 v33.27,55.88 | C1.2 v37.08,69.6 | C5.2 v37.08,67.31 | C7.2 v37.08,65.02 | C14.2 v53.34,52.58 | C12.2 v53.85,50.29 | C19.2 v8.64,46.74 | C13.2 v32,42.68 | C24.2 v73.15,27.94 | C25.2 v75.95,27.94 | U7.2 v77.47,67.56
  Top 0.813: S1.1.2 S1.1.1 | X2.GND v32.77,23.62 | C20.2 v31.24,36.58 | C18.2 v47.24,28.45 | C4.1 C3.1
  pour Bottom (no thermals): 0,84.84 79.25,84.84 79.25,0 0,0
IRQ  (via drill 0.35)
  Top 0.305: U3.10 41.25,36.68 v41.4,36.83 | U1.16 36.61,53.86 37.05,53.42 37.62,53.42 38.06,53.86 v40.15,53.86
  Bottom 0.305: v41.4,36.83 40.84,37.39 40.84,52.85 40.15,53.54 v40.15,53.86
LEFTDECOUP  (via drill 0.35)
  Top 0.254: 41.91,65.53 41.91,68.58 40.89,69.6 v40.89,69.85 | 41.91,65.53 U1.89 | R8.1 41.82,65.44 41.91,65.53
  Bottom 0.254: J9.2 39.88,70.87 v40.89,69.85
MISO  (via drill 0.35)
  Top 0.254: U2.10 14.11,43.58 21.41,50.88 U1.22 | 50.09,40.74 U$1.17 49.33,40.69 49.02,40.39 49.02,35.81 46.99,33.78 45.21,33.78 43.69,32.26 39.12,32.26 38.61,32.77 38.61,34.02 U3.14
  Top 0.305: U3.14 38.65,35.01 37.59,36.07 v37.59,36.83 | U1.22 37.61,50.88 v37.69,50.8 | J1.1 4.06,58.67 2.54,57.15 2.54,45.19 7.24,40.49 12.82,40.49 14.11,41.77 U2.10
  Bottom 0.305: v37.69,50.8 37.69,50.64 37.46,50.42 37.46,36.96 v37.59,36.83
MOSI  (via drill 0.35)
  Top 0.254: U1.21 21.16,51.38 13.46,43.69 U2.11 | U3.13 39.3,32.99 39.62,32.66 43.52,32.66 45.15,34.29 46.74,34.29 48.51,36.07 48.51,40.89 48.95,41.33 U$1.16
  Top 0.305: U3.13 39.3,35.12 38.5,35.92 v38.5,36.83 | U1.21 37.31,51.38 37.41,51.48 38.27,51.48 v38.35,51.56 | J1.4 6.1,57.4 3.81,57.4 3.05,56.64 3.05,45.33 7.43,40.95 12.63,40.95 13.46,41.77 U2.11
  Bottom 0.305: v38.5,36.83 38.5,51.41 v38.35,51.56
N$2
  Top 0.762: U6.4 74.49,32.56 73.25,31.33 C24.1
RADIO_CSN_3V3  (via drill 0.35)
  Top 0.254: v41.66,20.07 42.16,20.57 42.16,23.37 41.66,23.88 41.66,26.16 41.25,26.57 U3.7 | X2.CSN 36.4,20.07 v38.1,20.07
  Bottom 0.254: v38.1,20.07 v41.66,20.07
RADIO_IRQ_3V3  (via drill 0.35)
  Top 0.254: v40.89,15.49 40.89,25.91 40.6,26.2 U3.6 | X2.IRQ 36.91,15.49 v38.86,15.49
  Bottom 0.254: v38.86,15.49 v40.89,15.49
RADIO_MISO_3V3
  Top 0.254: U3.3 38.65,26.96 37.59,25.91 36.98,25.91 34.19,23.11 34.19,22.64 34.21,22.62 34.21,15.34 X2.MISO
RADIO_MOSI_3V3
  Top 0.254: U3.4 39.3,18.98 37.34,17.02 35.9,17.02 X2.MOSI
RADIO_SCK_3V3
  Top 0.254: U3.5 39.95,15.06 37.59,12.7 32,12.7 31.5,13.21 31.5,15.16 X2.SCK
RADIO_SS  (via drill 0.35)
  Top 0.254: U1.15 37.06,54.38 v37.34,54.1
  Top 0.305: U3.16 36.58,34.83 v36.58,36.83
  Bottom 0.305: v36.58,36.83 36.58,42.21 37.01,42.64 37.01,53.77 v37.34,54.1
RADIO_SS_3V3
  Top 0.254: U3.1 37.35,26.93 33.78,23.37 33.78,22.47 33.81,22.45 33.81,20.01 X2.CE
RIGHTDECOUP  (via drill 0.35)
  Top 0.254: 42.42,65.53 42.42,69.7 v41.4,70.72 | 42.42,65.53 U1.88 | R9.1 42.51,65.44 42.42,65.53
  Bottom 0.254: J10.2 46.99,75.95 43.43,75.95 40.39,72.9 40.39,71.12 40.79,70.72 v41.4,70.72
RS  (via drill 0.35)
  Top 0.254: U4.8 65.99,45.72 | 65.99,45.72 v66.8,45.72 | 65.99,45.72 66.04,45.77 R7.1
  Bottom 0.254: v66.8,45.72 66.82,45.74 J6.1
SCK  (via drill 0.35)
  Top 0.254: U1.20 20.88,51.87 12.81,43.8 U2.12 | U$1.14 49.23,42.62 48.11,41.5 48.11,39.12 46.58,37.59 40.17,37.59 39.37,36.79
  Top 0.305: U3.12 39.95,35.49 39.37,36.07 39.37,36.79 v39.41,36.83 | U1.20 37.14,51.87 37.52,52.24 39.04,52.24 v39.12,52.32 | J1.3 3.56,54.86 3.56,45.47 7.62,41.4 12.45,41.4 12.81,41.77 U2.12
  Bottom 0.305: v39.12,52.32 39.41,52.03 v39.41,36.83
SD_MISO_3V3
  Top 0.254: U2.5 14.11,36.18 15.49,34.8 15.49,29.46 13.72,27.69 9.91,27.69 9.38,28.21 J11.7
SD_MOSI_3V3
  Top 0.254: J11.2 21.88,37.05 20.57,38.35 13.72,38.35 13.46,38.1 U2.4
SD_SCK_3V3
  Top 0.254: U2.3 12.81,35.96 14.48,34.29 14.48,32.59 J11.5
SD_SS
  Top 0.254: U1.19 20.62,52.38 12.16,43.91 U2.13
SD_SS_3V3
  Top 0.254: U2.2 12.16,38.07 12.95,38.86 21.59,38.86 24.31,36.15 J11.1
XTAL1
  Top 0.254: U1.34 40.41,46.46 41.15,45.72 43.94,45.72 44.54,45.12 C3.2 44.54,41.06 Q1.1
XTAL2
  Top 0.254: U1.33 39.93,45.77 39.62,45.47 35.73,45.47 35.08,44.82 34.83,44.82 C4.2 34.46,40.8 Q1.2
(copper drawn outside any net)
  shapes: Top area x2

### Text on the board
tPlace: RoboJackets / IGVC Central Diagnostics Board / v0.2 BOARD #: | 12V | 5V | 3V3
tNames: LEFT / DECOUP | RIGHT / DECOUP | 12V | MAST | ESTOP | MINIBOARDS | Programming | LOGIC BOARD